# EAGLE design Carro_BT_V2 (EAGLE 9.6.2)
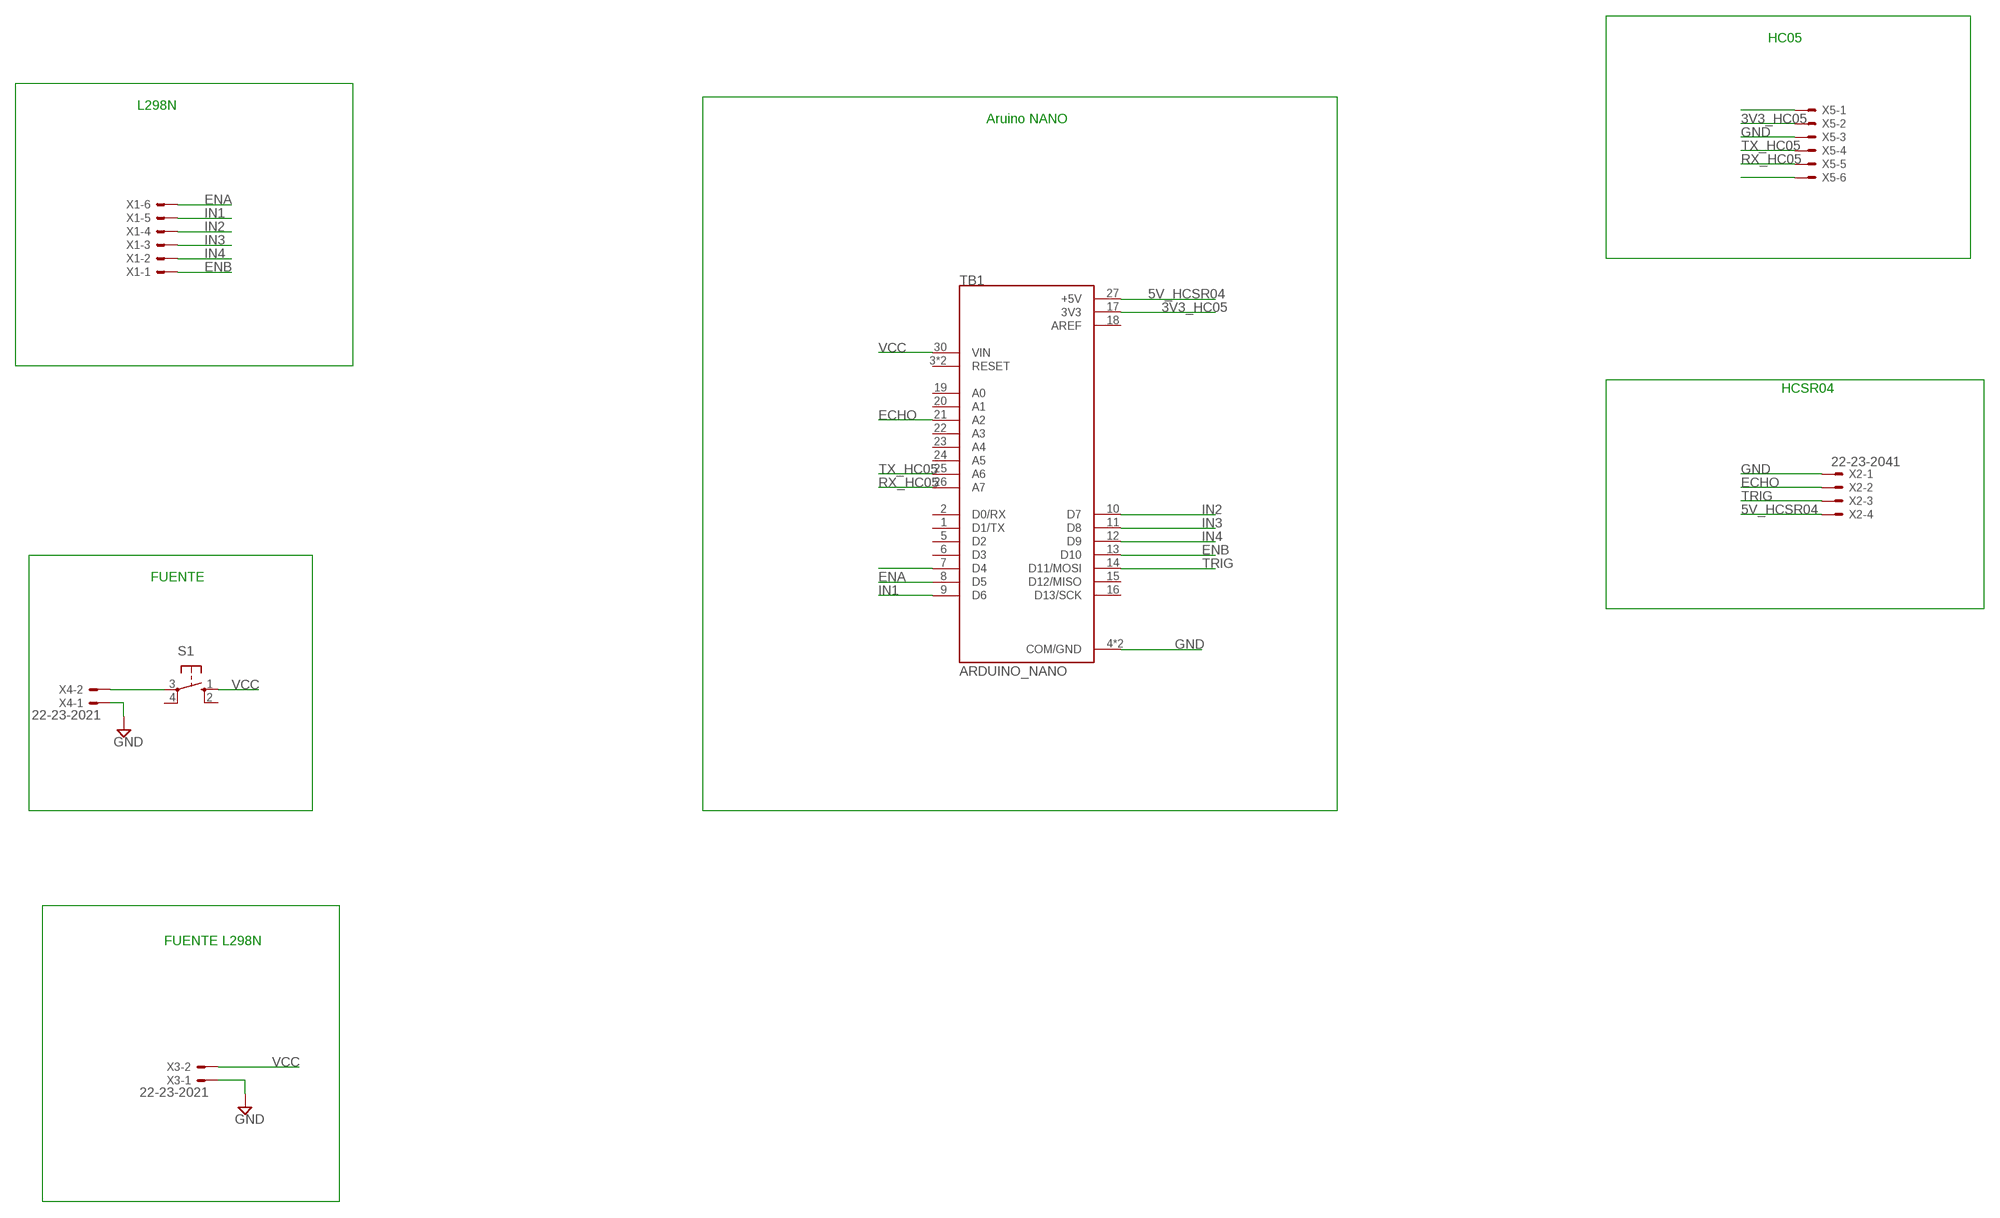
[diagram p0: schematic, sheet 1]

## Parts
S1  10-XX  [B3F-10XX]
TB1  ARDUINO_NANO  [SHIELD_ARDUINO_NANO]
X1  22-23-2061  [22-23-2061]
X2  22-23-2041  [22-23-2041]
X3  22-23-2021  [22-23-2021]
X4  22-23-2021  [22-23-2021]
X5  22-23-2061  [22-23-2061]

## Nets
3V3_HC05: TB1.17(3V3) X5.2
5V_HCSR04: TB1.27(+5V) X2.4
ECHO: TB1.21(A2) X2.2
ENA: TB1.8(D5) X1.6
ENB: TB1.13(D10) X1.1
GND: TB1.4(COM/GND) TB1.29(COM/GND) X2.1 X3.1 X4.1 X5.3
IN1: TB1.9(D6) X1.5
IN2: TB1.10(D7) X1.4
IN3: TB1.11(D8) X1.3
IN4: TB1.12(D9) X1.2
N$6: S1.3(P) X4.2
N$8: TB1.7(D4)
N$11: X5.1
N$12: X5.6
RX_HC05: TB1.26(A7) X5.5
TRIG: TB1.14(D11/MOSI) X2.3
TX_HC05: TB1.25(A6) X5.4
VCC: S1.1(S) TB1.30(VIN) X3.2
Unconnected: S1.2(S1) S1.4(P1) TB1.1(D1/TX) TB1.2(D0/RX) TB1.3(RESET) TB1.5(D2) TB1.6(D3) TB1.15(D12/MISO) TB1.16(D13/SCK) TB1.19(A0) TB1.20(A1) TB1.22(A3) TB1.23(A4) TB1.24(A5) TB1.28(RESET)

## Notes on the sheet
- HC05
- L298N
- Aruino NANO
- HCSR04
- FUENTE
- FUENTE L298N

## Power pins joined to a net without a drawn wire
AREF: TB1.18(AREF)

## Library data of the parts
S1 = switch-omron:10-XX: OMRON SWITCH; MPN: B3F-1000; OC_FARNELL: 176432; OC_NEWARK: 36M3542
TB1 = ARDUINO_NANO:ARDUINO_NANO: Arduino Nano, Through Hole; AVAILABILITY: Unavailable; DESCRIPTION: ATmega4809 Arduino Nano Every with Headers AVR® AVR MCU 8-Bit Embedded Evaluation Board; MF: Arduino; MP: ARDUINO NANO; PACKAGE: None; PRICE: None
X1 X5 = con-molex:22-23-2061: .100" (2.54mm) Center Header - 6 Pin; MF: MOLEX; MPN: 22-23-2061; OC_FARNELL: 1462922; OC_NEWARK: 27C1933
X2 = con-molex:22-23-2041: .100" (2.54mm) Center Header - 4 Pin; MF: MOLEX; MPN: 22-23-2041; OC_FARNELL: 1462920; OC_NEWARK: 38C0355
X3 X4 = con-molex:22-23-2021: .100" (2.54mm) Center Header - 2 Pin; MF: MOLEX; MPN: 22-23-2021; OC_FARNELL: 1462926; OC_NEWARK: 25C3832

## Board
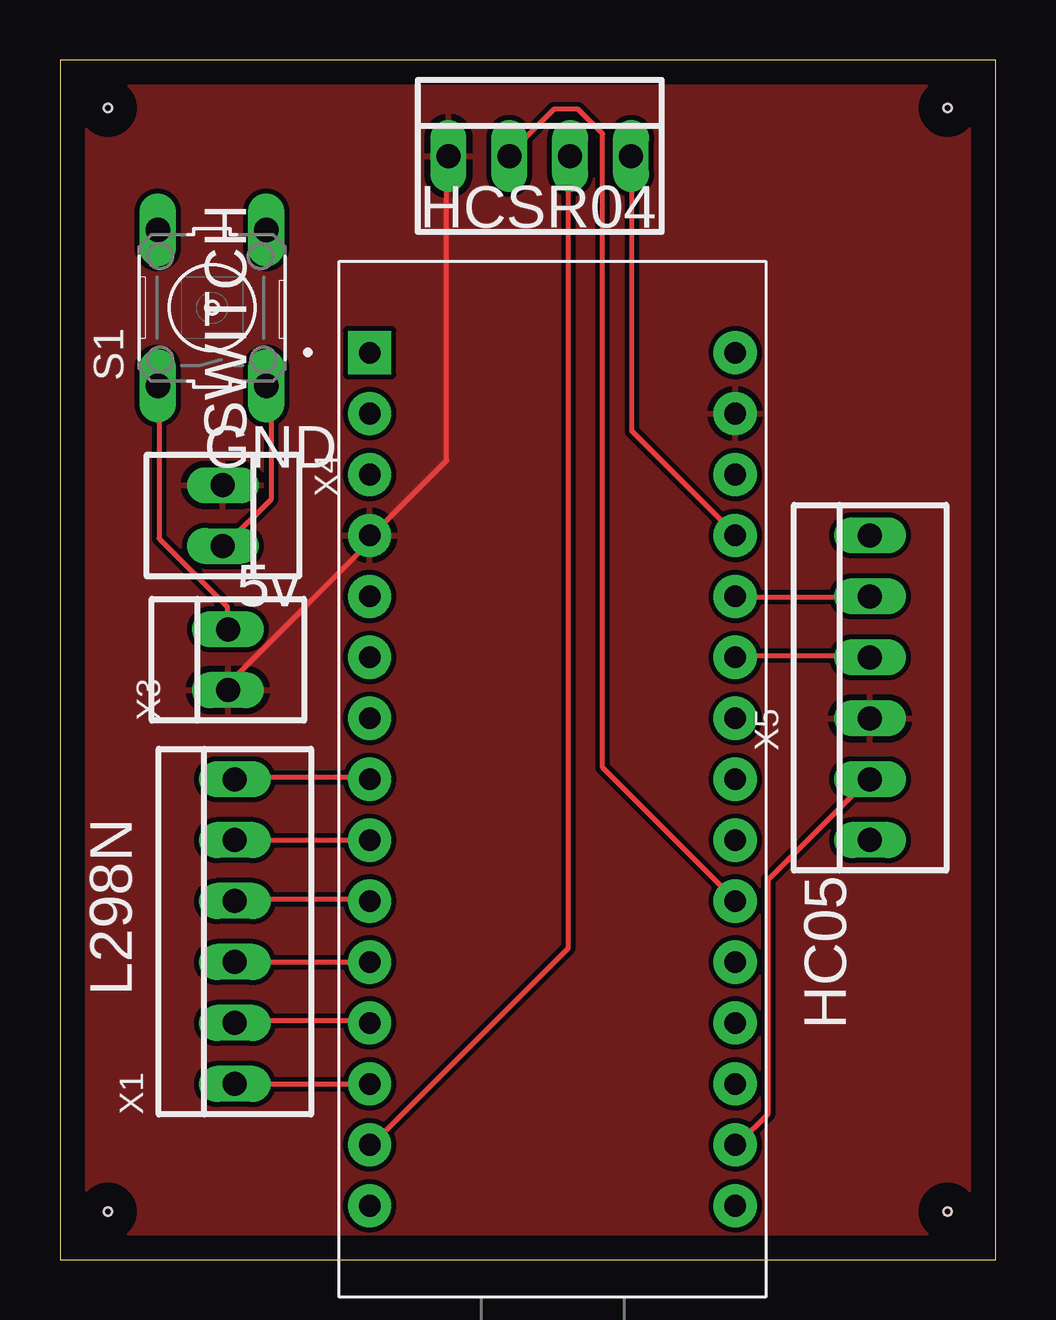
[diagram p1: board, top side]
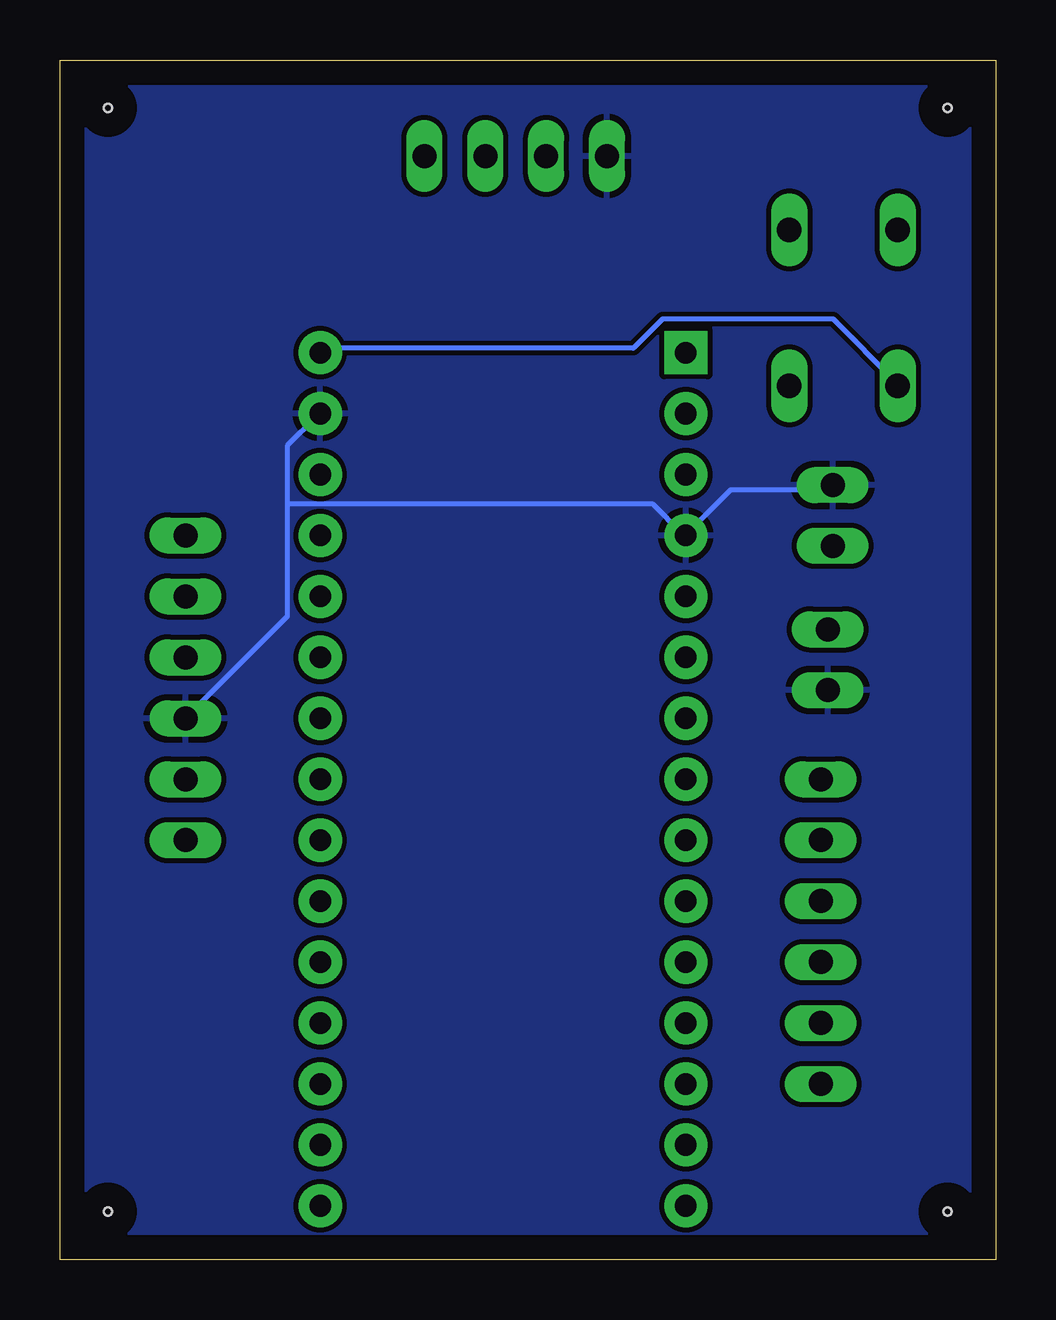
[diagram p2: board, bottom side, seen from below]

Size 39 x 50 mm. Coordinates in mm from the lower left corner, seen from the top.
Outline: 0,0 39,0 39,50 0,50 0,0
Copper layers (1*16): Top 0.035mm / dielectric 1.5mm / Bottom 0.035mm
Design rules "default *": minimum track width 8mil, minimum drill 0.35mm, track to track 8mil, track to pad 8mil, pad to pad 8mil, via to via 8mil, smd to smd 6mil, copper to edge 40mil, drill to drill 6mil, minimum pad ring 10mil, minimum via ring 8mil, stop-mask expansion 4mil, vias tented up to drill 0mil, thermal gap 10mil
Holes 0.35 mm at 2,48 37,48 37,2 2,2

### Footprints (pad centres in the part's own frame; a part is rotated, then mirrored left to right if it is on the bottom)
B3F-10XX = drill 1.016 long: 1 -3.251,2.261; 2 3.251,2.261; 3 -3.251,-2.261; 4 3.251,-2.261
SHIELD_ARDUINO_NANO = drill 0.9 pad 1.8 square: 1 -7.62,17.78 | drill 0.9 pad 1.8: 2 -7.62,15.24; 3 -7.62,12.7; 4 -7.62,10.16; 5 -7.62,7.62; 6 -7.62,5.08; 7 -7.62,2.54; 8 -7.62,0; 9 -7.62,-2.54; 10 -7.62,-5.08; 11 -7.62,-7.62; 12 -7.62,-10.16; 13 -7.62,-12.7; 14 -7.62,-15.24; 15 -7.62,-17.78; 16 7.62,-17.78; 17 7.62,-15.24; 18 7.62,-12.7; 19 7.62,-10.16; 20 7.62,-7.62; 21 7.62,-5.08; 22 7.62,-2.54; 23 7.62,0; 24 7.62,2.54; 25 7.62,5.08; 26 7.62,7.62; 27 7.62,10.16; 28 7.62,12.7; 29 7.62,15.24; 30 7.62,17.78
22-23-2061 = drill 1 long: 1 -6.35,0; 2 -3.81,0; 3 -1.27,0; 4 1.27,0; 5 3.81,0; 6 6.35,0
22-23-2041 = drill 1 long: 1 -3.81,0; 2 -1.27,0; 3 1.27,0; 4 3.81,0
22-23-2021 = drill 1 long: 1 -1.27,0; 2 1.27,0

### Placement (x,y rotation side)
S1  6.34,39.67 90 top
TB1  20.53,20.02 0 top
X1  7.29,13.67 90 top
X2  20,46 0 top
X3  7,25 90 top
X4  6.79,31.01 270 top
X5  33.77,23.83 90 top

### Tracks (layer width: path | path; a pad name or v marks a point on that pad's centre or on a via)
3V3_HC05
  Top 0.203: X5.2 33.59,19.9 29.53,15.83 29.53,6.08 28.31,4.86 TB1.17
5V_HCSR04
  Top 0.203: X2.4 23.84,45.91 23.84,34.53 28.11,30.26 TB1.27
ECHO
  Top 0.203: X2.2 18.76,46.11 20.59,47.94 21.6,47.94 22.62,46.92 22.62,20.51 28.11,15.02 TB1.21
ENA
  Top 0.203: X1.6 7.38,20.1 12.87,20.1 TB1.8
ENB
  Top 0.203: X1.1 7.38,7.3 12.87,7.3 TB1.13
GND
  Top 0.203: X3.1 7.18,23.76 7.18,24.16 12.91,29.9 TB1.4 13.07,30.26 16.12,33.31 16.12,45.91 X2.1
  Top 0.305: 12.88,30.21 TB1.4
  Bottom 0.203: 29.53,31.48 29.53,33.92 28.31,35.14 TB1.29 | 29.53,31.48 29.53,26.81 33.59,22.74 X5.3 | X4.1 6.97,32.09 11.04,32.09 12.87,30.26 TB1.4 13.07,30.26 14.29,31.48 29.53,31.48
  pour Top: 1,49 1,1 38,1 38,49
  pour Bottom: 1,49 1,1 38,1 38,49
IN1
  Top 0.203: X1.5 7.38,17.46 12.87,17.46 TB1.9
IN2
  Top 0.203: X1.4 7.38,15.02 12.87,15.02 TB1.10
IN3
  Top 0.203: X1.3 7.38,12.38 12.87,12.38 TB1.11
IN4
  Top 0.203: X1.2 7.38,9.94 12.87,9.94 TB1.12
N$6
  Top 0.203: X4.2 6.97,29.85 8.8,31.68 8.8,36.36 S1.3
RX_HC05
  Top 0.203: X5.5 33.59,27.62 28.31,27.62 TB1.26
TRIG
  Top 0.203: X2.3 21.2,45.91 21.2,12.99 13.07,4.86 TB1.14
TX_HC05
  Top 0.203: X5.4 33.59,25.18 28.31,25.18 TB1.25
VCC
  Top 0.203: X3.2 6.97,26.4 6.97,27.21 4.13,30.06 4.13,36.36 S1.1
  Bottom 0.203: TB1.30 28.11,37.98 15.1,37.98 13.88,39.2 6.77,39.2 4.13,36.56 S1.1

### Text on the board
tPlace: SWITCH | HCSR04 | GND | 5v | HC05 | L298N